# Altium schematic sheet RGB LED Beta1.SchDoc
size A4
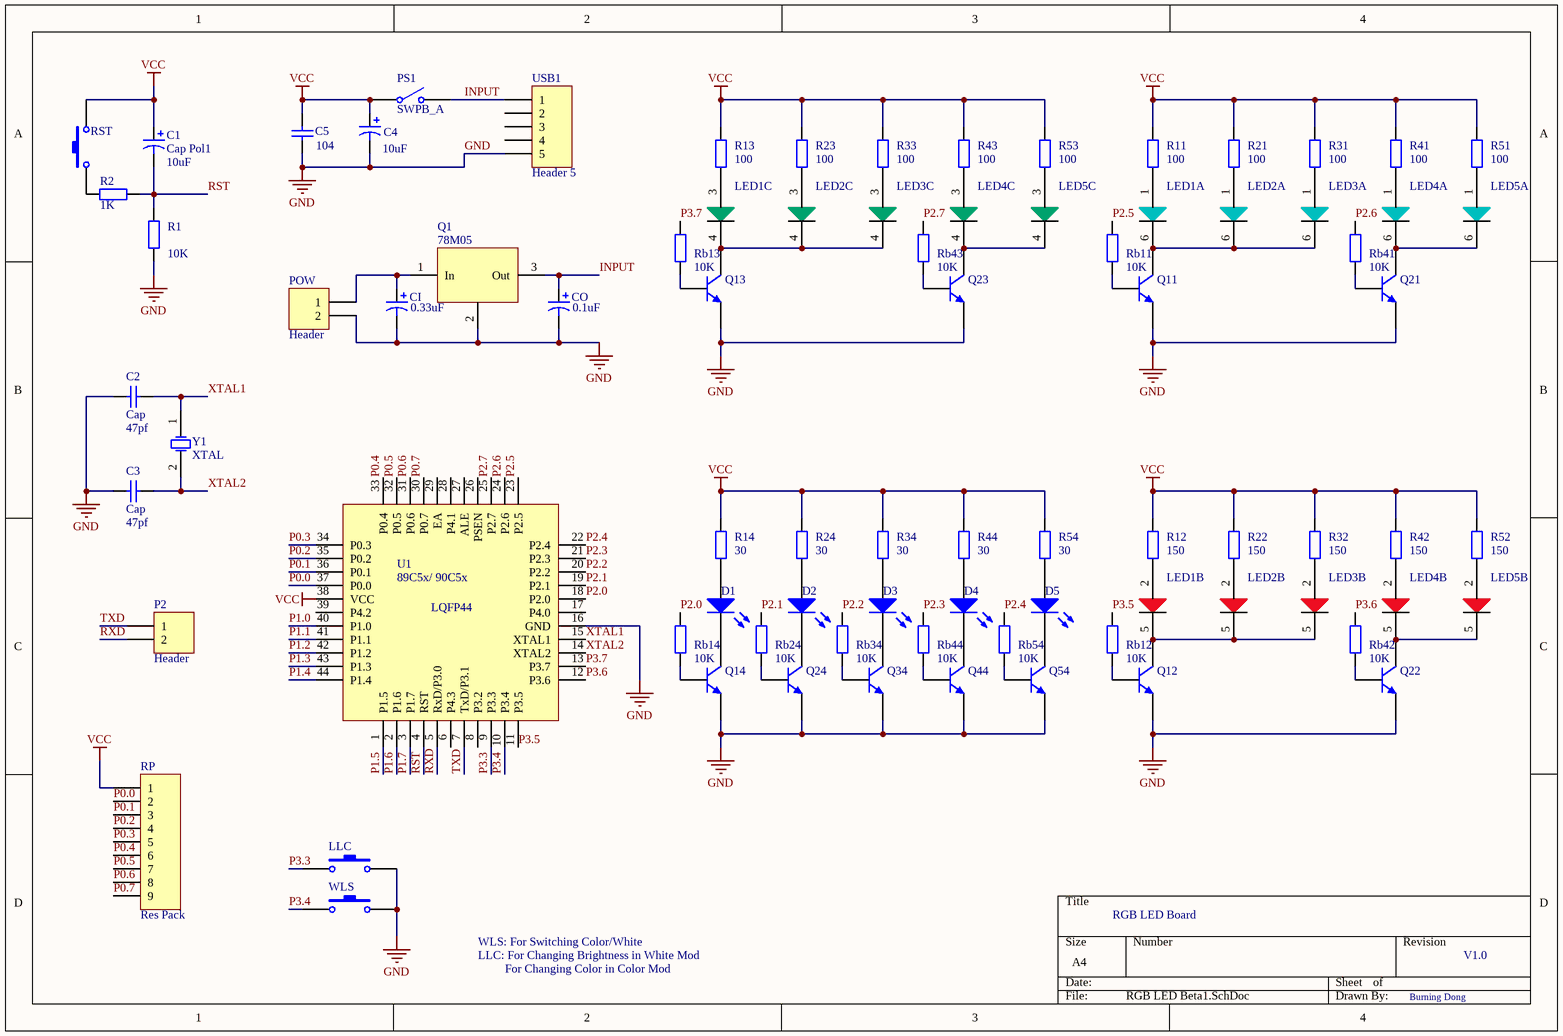
[diagram p0: RGB LED Beta1.SchDoc]

## Parts
C1  Cap Pol1  value 10uF  [C0805]
C2  Cap  value 47pf  [C0805]
C3  Cap  value 47pf  [C0805]
C4  value 10uF  [C0805]  (hidden comment: Cap Pol1)
C5  value 104  [C1206]  (hidden comment: Cap)
CI  value 0.33uF  [C0805]  (hidden comment: Cap Pol1)
CO  value 0.1uF  [C0805]  (hidden comment: Cap Pol1)
D1  LED0  [LED 5050 NoneRGB]  (value not drawn)
D2  LED0  [LED 5050 NoneRGB]  (value not drawn)
D3  LED0  [LED 5050 NoneRGB]  (value not drawn)
D4  LED0  [LED 5050 NoneRGB]  (value not drawn)
D5  LED0  [LED 5050 NoneRGB]  (value not drawn)
LED1  RGB LED  [LED 5050]  (value not drawn)  (parts A,B,C of 3)
LED2  RGB LED  [LED 5050]  (value not drawn)  (parts A,B,C of 3)
LED3  RGB LED  [LED 5050]  (value not drawn)  (parts A,B,C of 3)
LED4  RGB LED  [LED 5050]  (value not drawn)  (parts A,B,C of 3)
LED5  RGB LED  [LED 5050]  (value not drawn)  (parts A,B,C of 3)
LLC  SW-PB  [SW_A]  (value not drawn)
P2  Header  [HDR1X2]
POW  Header  [HDR1X2]
PS1  SWPB_A  [SW_B]
Q1  78M05  [TO_252]
Q11  s8050  [SOT-23_A_N]  (value not drawn)
Q12  s8050  [SOT-23_A_N]  (value not drawn)
Q13  s8050  [SOT-23_A_N]  (value not drawn)
Q14  s8050  [SOT-23_A_N]  (value not drawn)
Q21  s8050  [SOT-23_A_N]  (value not drawn)
Q22  s8050  [SOT-23_A_N]  (value not drawn)
Q23  s8050  [SOT-23_A_N]  (value not drawn)
Q24  s8050  [SOT-23_A_N]  (value not drawn)
Q34  s8050  [SOT-23_A_N]  (value not drawn)
Q44  s8050  [SOT-23_A_N]  (value not drawn)
Q54  s8050  [SOT-23_A_N]  (value not drawn)
R1  value 10K  [6-0805_N]  (hidden comment: Res2)
R2  value 1K  [6-0805_N]  (hidden comment: Res2)
R11  value 100  [6-0805_N]  (hidden comment: Res2)
R12  value 150  [6-0805_N]  (hidden comment: Res2)
R13  value 100  [6-0805_N]  (hidden comment: Res2)
R14  value 30  [6-0805_N]  (hidden comment: Res2)
R21  value 100  [6-0805_N]  (hidden comment: Res2)
R22  value 150  [6-0805_N]  (hidden comment: Res2)
R23  value 100  [6-0805_N]  (hidden comment: Res2)
R24  value 30  [6-0805_N]  (hidden comment: Res2)
R31  value 100  [6-0805_N]  (hidden comment: Res2)
R32  value 150  [6-0805_N]  (hidden comment: Res2)
R33  value 100  [6-0805_N]  (hidden comment: Res2)
R34  value 30  [6-0805_N]  (hidden comment: Res2)
R41  value 100  [6-0805_N]  (hidden comment: Res2)
R42  value 150  [6-0805_N]  (hidden comment: Res2)
R43  value 100  [6-0805_N]  (hidden comment: Res2)
R44  value 30  [6-0805_N]  (hidden comment: Res2)
R51  value 100  [6-0805_N]  (hidden comment: Res2)
R52  value 150  [6-0805_N]  (hidden comment: Res2)
R53  value 100  [6-0805_N]  (hidden comment: Res2)
R54  value 30  [6-0805_N]  (hidden comment: Res2)
Rb11  value 10K  [6-0805_N]  (hidden comment: Res2)
Rb12  value 10K  [6-0805_N]  (hidden comment: Res2)
Rb13  value 10K  [6-0805_N]  (hidden comment: Res2)
Rb14  value 10K  [6-0805_N]  (hidden comment: Res2)
Rb24  value 10K  [6-0805_N]  (hidden comment: Res2)
Rb34  value 10K  [6-0805_N]  (hidden comment: Res2)
Rb41  value 10K  [6-0805_N]  (hidden comment: Res2)
Rb42  value 10K  [6-0805_N]  (hidden comment: Res2)
Rb43  value 10K  [6-0805_N]  (hidden comment: Res2)
Rb44  value 10K  [6-0805_N]  (hidden comment: Res2)
Rb54  value 10K  [6-0805_N]  (hidden comment: Res2)
RP  Res Pack  [HDR1X9]
RST  SW-PB  [SW_A]  (value not drawn)
U1  89C5x/ 90C5x  [TQFP44_N]
USB1  Header 5  [Micro_USB_B]
WLS  SW-PB  [SW_A]  (value not drawn)
Y1  XTAL  [XTAL]

## Nets
GND: C2.1 C3.1 C4.2 C5.2 CI.2 CO.2 LLC.2 POW.2 Q1.2(Com) Q11.1(E) Q12.1(E) Q13.1(E) Q14.1(E) Q21.1(E) Q22.1(E) Q23.1(E) Q24.1(E) Q34.1(E) Q44.1(E) Q54.1(E) R1.2 U1.16(GND) USB1.5 WLS.2
VCC: C1.1 C4.1 C5.1 PS1.1(COMMON) R11.1 R12.1 R13.1 R14.1 R21.1 R22.1 R23.1 R24.1 R31.1 R32.1 R33.1 R34.1 R41.1 R42.1 R43.1 R44.1 R51.1 R52.1 R53.1 R54.1 RP.1 RST.2 U1.38(VCC)
INPUT: CO.1 PS1.2(NO) Q1.3(Out) USB1.1
P0.0: RP.2 U1.37(P0.0)
P0.1: RP.3 U1.36(P0.1)
P0.2: RP.4 U1.35(P0.2)
P0.3: RP.5 U1.34(P0.3)
P0.4: RP.6 U1.33(P0.4)
P0.5: RP.7 U1.32(P0.5)
P0.6: RP.8 U1.31(P0.6)
P0.7: RP.9 U1.30(P0.7)
P1.0: U1.40(P1.0)
P1.1: U1.41(P1.1)
P1.2: U1.42(P1.2)
P1.3: U1.43(P1.3)
P1.4: U1.44(P1.4)
P1.5: U1.1(P1.5)
P1.6: U1.2(P1.6)
P1.7: U1.3(P1.7)
P2.0: Rb14.1 U1.18(P2.0)
P2.1: Rb24.1 U1.19(P2.1)
P2.2: Rb34.1 U1.20(P2.2)
P2.3: Rb44.1 U1.21(P2.3)
P2.4: Rb54.1 U1.22(P2.4)
P2.5: Rb11.1 U1.23(P2.5)
P2.6: Rb41.1 U1.24(P2.6)
P2.7: Rb43.1 U1.25(P2.7)
P3.3: LLC.1 U1.9(P3.3)
P3.4: U1.10(P3.4) WLS.1
P3.5: Rb12.1 U1.11(P3.5)
P3.6: Rb42.1 U1.12(P3.6)
P3.7: Rb13.1 U1.13(P3.7)
RST: C1.2 R1.1 R2.1 U1.4(RST)
RXD: P2.2 U1.5(RxD/P3.0)
TXD: P2.1 U1.7(TxD/P3.1)
XTAL1: C2.2 U1.15(XTAL1) Y1.1(OSC1)
XTAL2: C3.2 U1.14(XTAL2) Y1.2(OSC2)
NetCI_1: CI.1 POW.1 Q1.1(In)
NetD1_1: D1.1(A) R14.2
NetD1_2: D1.2(K) Q14.3(C)
NetD2_1: D2.1(A) R24.2
NetD2_2: D2.2(K) Q24.3(C)
NetD3_1: D3.1(A) R34.2
NetD3_2: D3.2(K) Q34.3(C)
NetD4_1: D4.1(A) R44.2
NetD4_2: D4.2(K) Q44.3(C)
NetD5_1: D5.1(A) R54.2
NetD5_2: D5.2(K) Q54.3(C)
NetLED1_1: LED1.1(B+) R11.2
NetLED1_2: LED1.2(B+) R12.2
NetLED1_3: LED1.3(B+) R13.2
NetLED1_4: LED1.4(B-) LED2.4(B-) LED3.4(B-) Q13.3(C)
NetLED1_5: LED1.5(B-) LED2.5(B-) LED3.5(B-) Q12.3(C)
NetLED1_6: LED1.6(B-) LED2.6(B-) LED3.6(B-) Q11.3(C)
NetLED2_1: LED2.1(B+) R21.2
NetLED2_2: LED2.2(B+) R22.2
NetLED2_3: LED2.3(B+) R23.2
NetLED3_1: LED3.1(B+) R31.2
NetLED3_2: LED3.2(B+) R32.2
NetLED3_3: LED3.3(B+) R33.2
NetLED4_1: LED4.1(B+) R41.2
NetLED4_2: LED4.2(B+) R42.2
NetLED4_3: LED4.3(B+) R43.2
NetLED4_4: LED4.4(B-) LED5.4(B-) Q23.3(C)
NetLED4_5: LED4.5(B-) LED5.5(B-) Q22.3(C)
NetLED4_6: LED4.6(B-) LED5.6(B-) Q21.3(C)
NetLED5_1: LED5.1(B+) R51.2
NetLED5_2: LED5.2(B+) R52.2
NetLED5_3: LED5.3(B+) R53.2
NetQ11_2: Q11.2(B) Rb11.2
NetQ12_2: Q12.2(B) Rb12.2
NetQ13_2: Q13.2(B) Rb13.2
NetQ14_2: Q14.2(B) Rb14.2
NetQ21_2: Q21.2(B) Rb41.2
NetQ22_2: Q22.2(B) Rb42.2
NetQ23_2: Q23.2(B) Rb43.2
NetQ24_2: Q24.2(B) Rb24.2
NetQ34_2: Q34.2(B) Rb34.2
NetQ44_2: Q44.2(B) Rb44.2
NetQ54_2: Q54.2(B) Rb54.2
NetR2_2: R2.2 RST.1

Not connected (* = marked no-connect by the designer): U1 6(P4.3) 8(P3.2) 17(P4.0) 26(PSEN) 27(ALE) 28(P4.1) 29(EA) 39(P4.2); USB1 2 3 4

## Notes on the sheet
- RGB LED Board
- LLC: For Changing Brightness in White Mod
- WLS: For Switching Color/White
- For Changing Color in Color Mod
- V1.0
- Burning Dong
- (in symbol 89C5x/ 90C5x) LQFP44

## Library data of the parts
C1 C4 CI CO = Cap Pol1: Polarized Capacitor (Radial); Published: 8-Jun-2000; LatestRevisionDate: 17-Jul-2002; LatestRevisionNote: Re-released for DXP Platform.; PackageReference: RB7.6-15; Publisher: Altium Limited; PackageDescription: Polarized Capacitor (Radial); 2 Leads
C2 C3 C5 = Cap: Capacitor; Published: 8-Jun-2000; LatestRevisionDate: 17-Jul-2002; LatestRevisionNote: Re-released for DXP Platform.; PackageReference: RAD-0.3; Publisher: Altium Limited; PackageDescription: Radial Cap, Thru-Hole; 2 Leads; 0.3 in Pin Spacing
D1-D5 = LED0: Typical INFRARED GaAs LED; Published: 8-Jun-2000; LatestRevisionDate: 08-Jul-2005; LatestRevisionNote: Mech Layer 1 removed.; PackageReference: LED-0; Publisher: Altium Limited; PackageDescription: LED; 2 Leads
LLC RST WLS = SW-PB: Switch; Published: 24-Mar-1999; LatestRevisionDate: 17-Jul-2002; LatestRevisionNote: Re-released for DXP Platform.; PackageReference: SPST-2; Publisher: Altium Limited; PackageDescription: Switch; 2 Leads
P2 POW = Header 2: Header, 2-Pin; LatestRevisionDate: 17-Jul-2002; LatestRevisionNote: Re-released for DXP Platform.; Publisher: Altium Limited
PS1 = SW-SPST: Single-Pole, Single-Throw Switch; Published: 24-Mar-1999; LatestRevisionDate: 17-Jul-2002; LatestRevisionNote: Re-released for DXP Platform.; PackageReference: SPST-2; Publisher: Altium Limited; PackageDescription: Switch; 2 Leads
Q1 = 78XX
Q11-Q14 Q21-Q24 Q34 Q44 Q54 = 2N3904: NPN General Purpose Amplifier; Published: 8-Jun-2000; LatestRevisionDate: 15-Jan-2003; LatestRevisionNote: PCB Footprint 'BCY-W3/D4.7' replaced; DatasheetVersion: 1997; PackageVersion: Sep-1998; PackageReference: TO-92A; Publisher: Altium Limited; PackageDescription: TO, Flat Index; 3 In-Line, Axial Leads; Body Dia. 4.5mm; Leads 0.51 x 0.48 mm (max); ComponentLink1Description: Manufacturer Link; ComponentLink1URL: http://www.fairchildsemi.com/; ComponentLink2Description: Datasheet; ComponentLink2URL: http://www.fairchildsemi.com/ds/2N%2F2N3904.pdf
R1 R2 R11-R14 R21-R24 R31-R34 R41-R44 R51-R54 Rb11-Rb14 Rb24 Rb34 Rb41-Rb44 Rb54 = Res2: Resistor; Published: 8-Jun-2000; LatestRevisionDate: 17-Jul-2002; LatestRevisionNote: Re-released for DXP Platform.; PackageReference: AXIAL-0.4; Publisher: Altium Limited; PackageDescription: Axial Device, Thru-Hole; 2 Leads; 0.4 in Pin Spacing
RP = Header 9: Header, 9-Pin; LatestRevisionDate: 17-Jul-2002; LatestRevisionNote: Re-released for DXP Platform.; Publisher: Altium Limited
USB1 = Header 5: Header, 5-Pin; LatestRevisionDate: 17-Jul-2002; LatestRevisionNote: Re-released for DXP Platform.; Publisher: Altium Limited
Y1 = XTAL: Crystal Oscillator; Published: 8-Jun-2000; LatestRevisionDate: 17-Jul-2002; LatestRevisionNote: Re-released for DXP Platform.; PackageReference: R38; Publisher: Altium Limited; PackageDescription: Crystal, Thru-Hole; 2 Leads; Body 3.1 x 8.2 mm (Dia.xH)